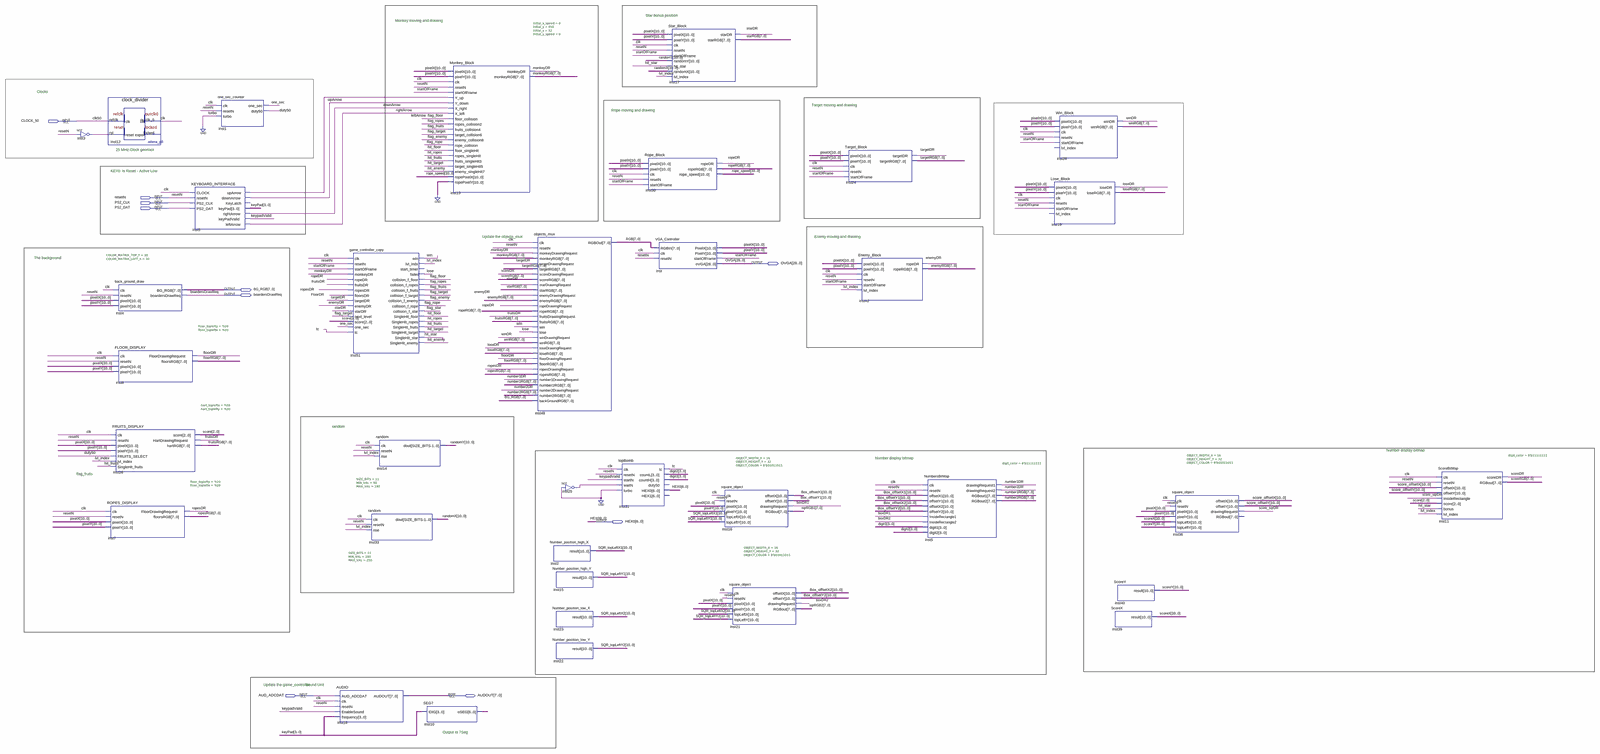
[diagram p0: schematic sheet, whole]
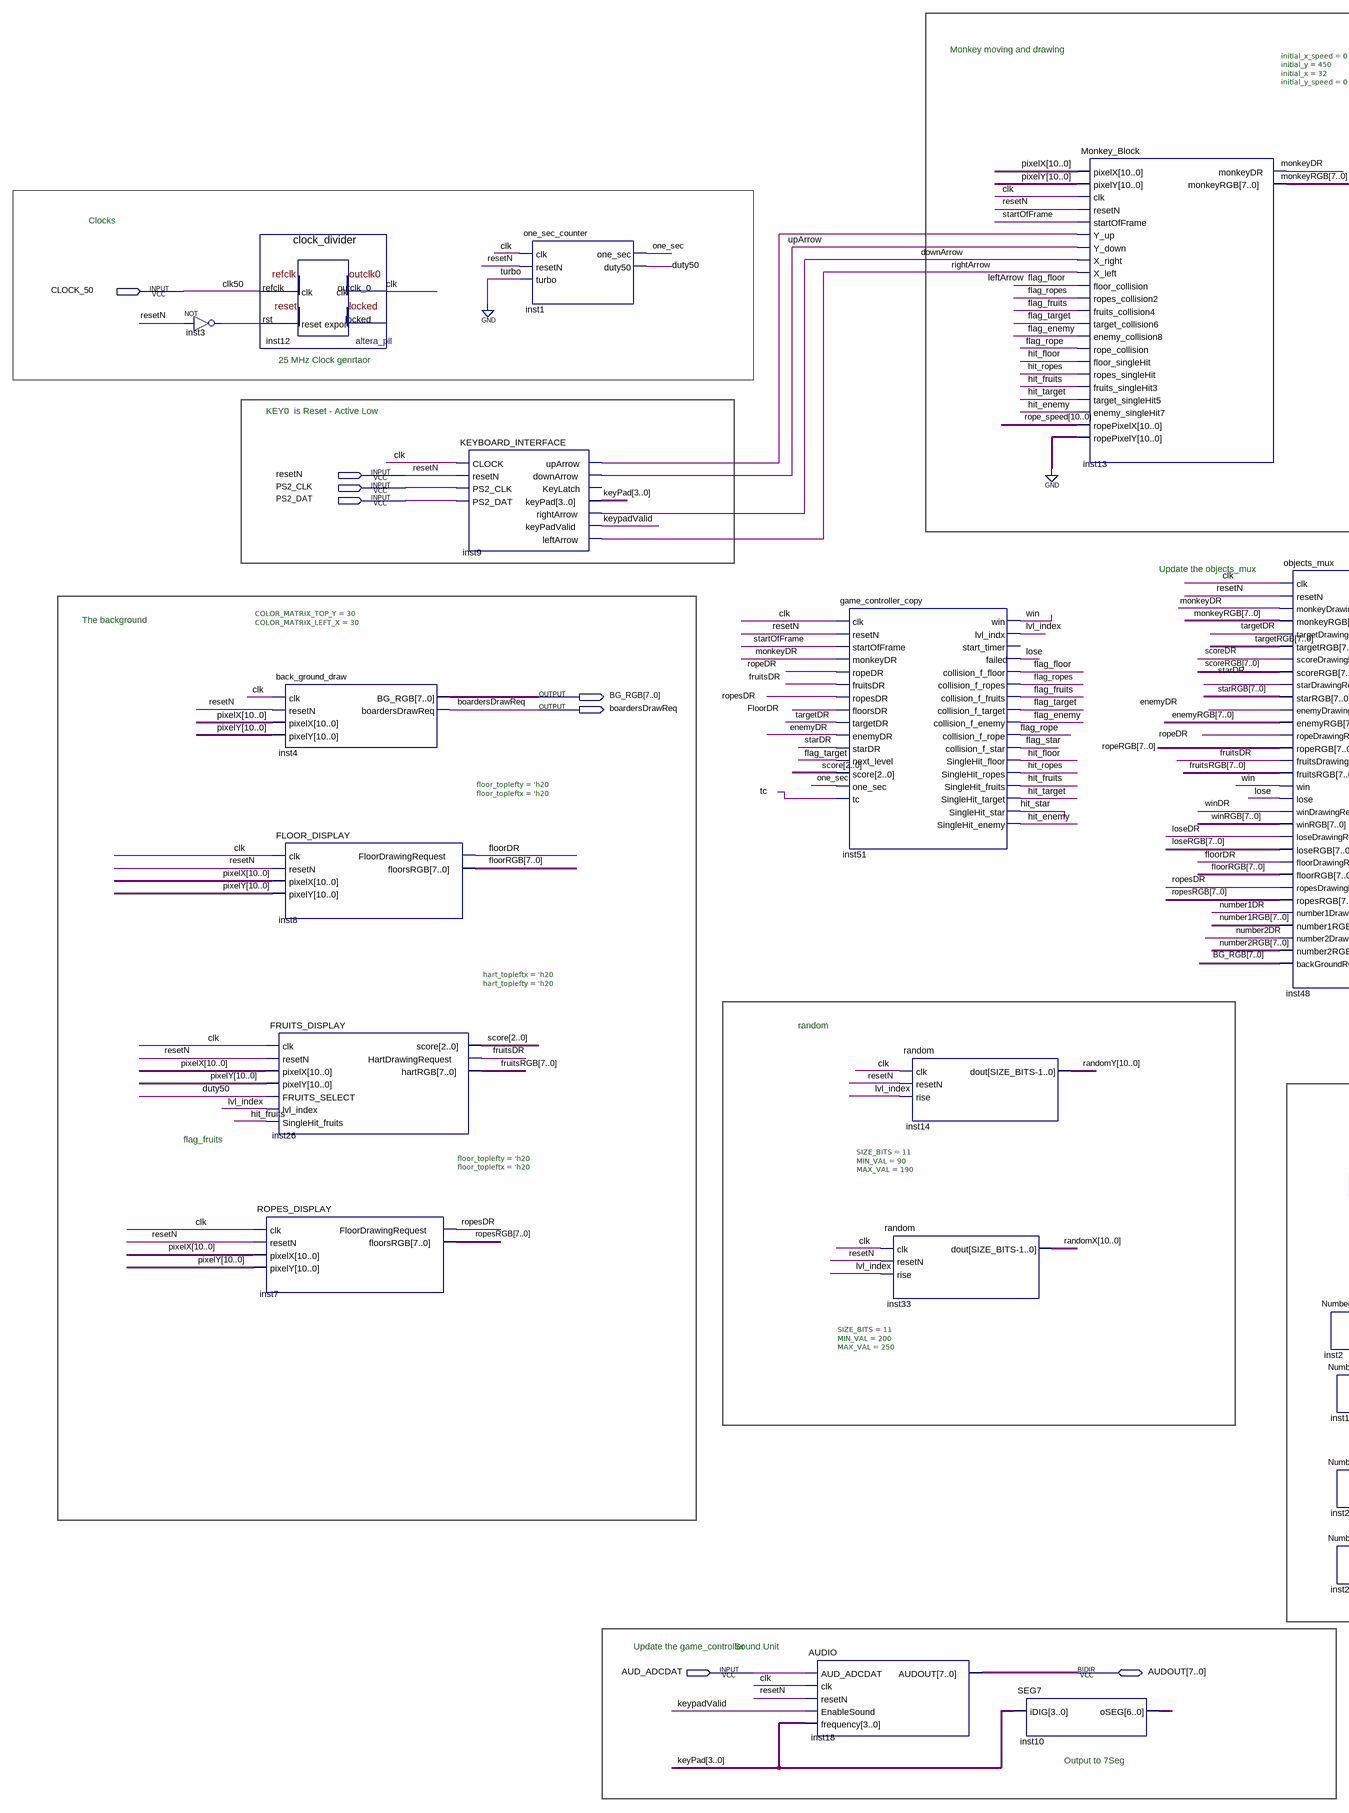
[diagram p1: schematic sheet, left part]
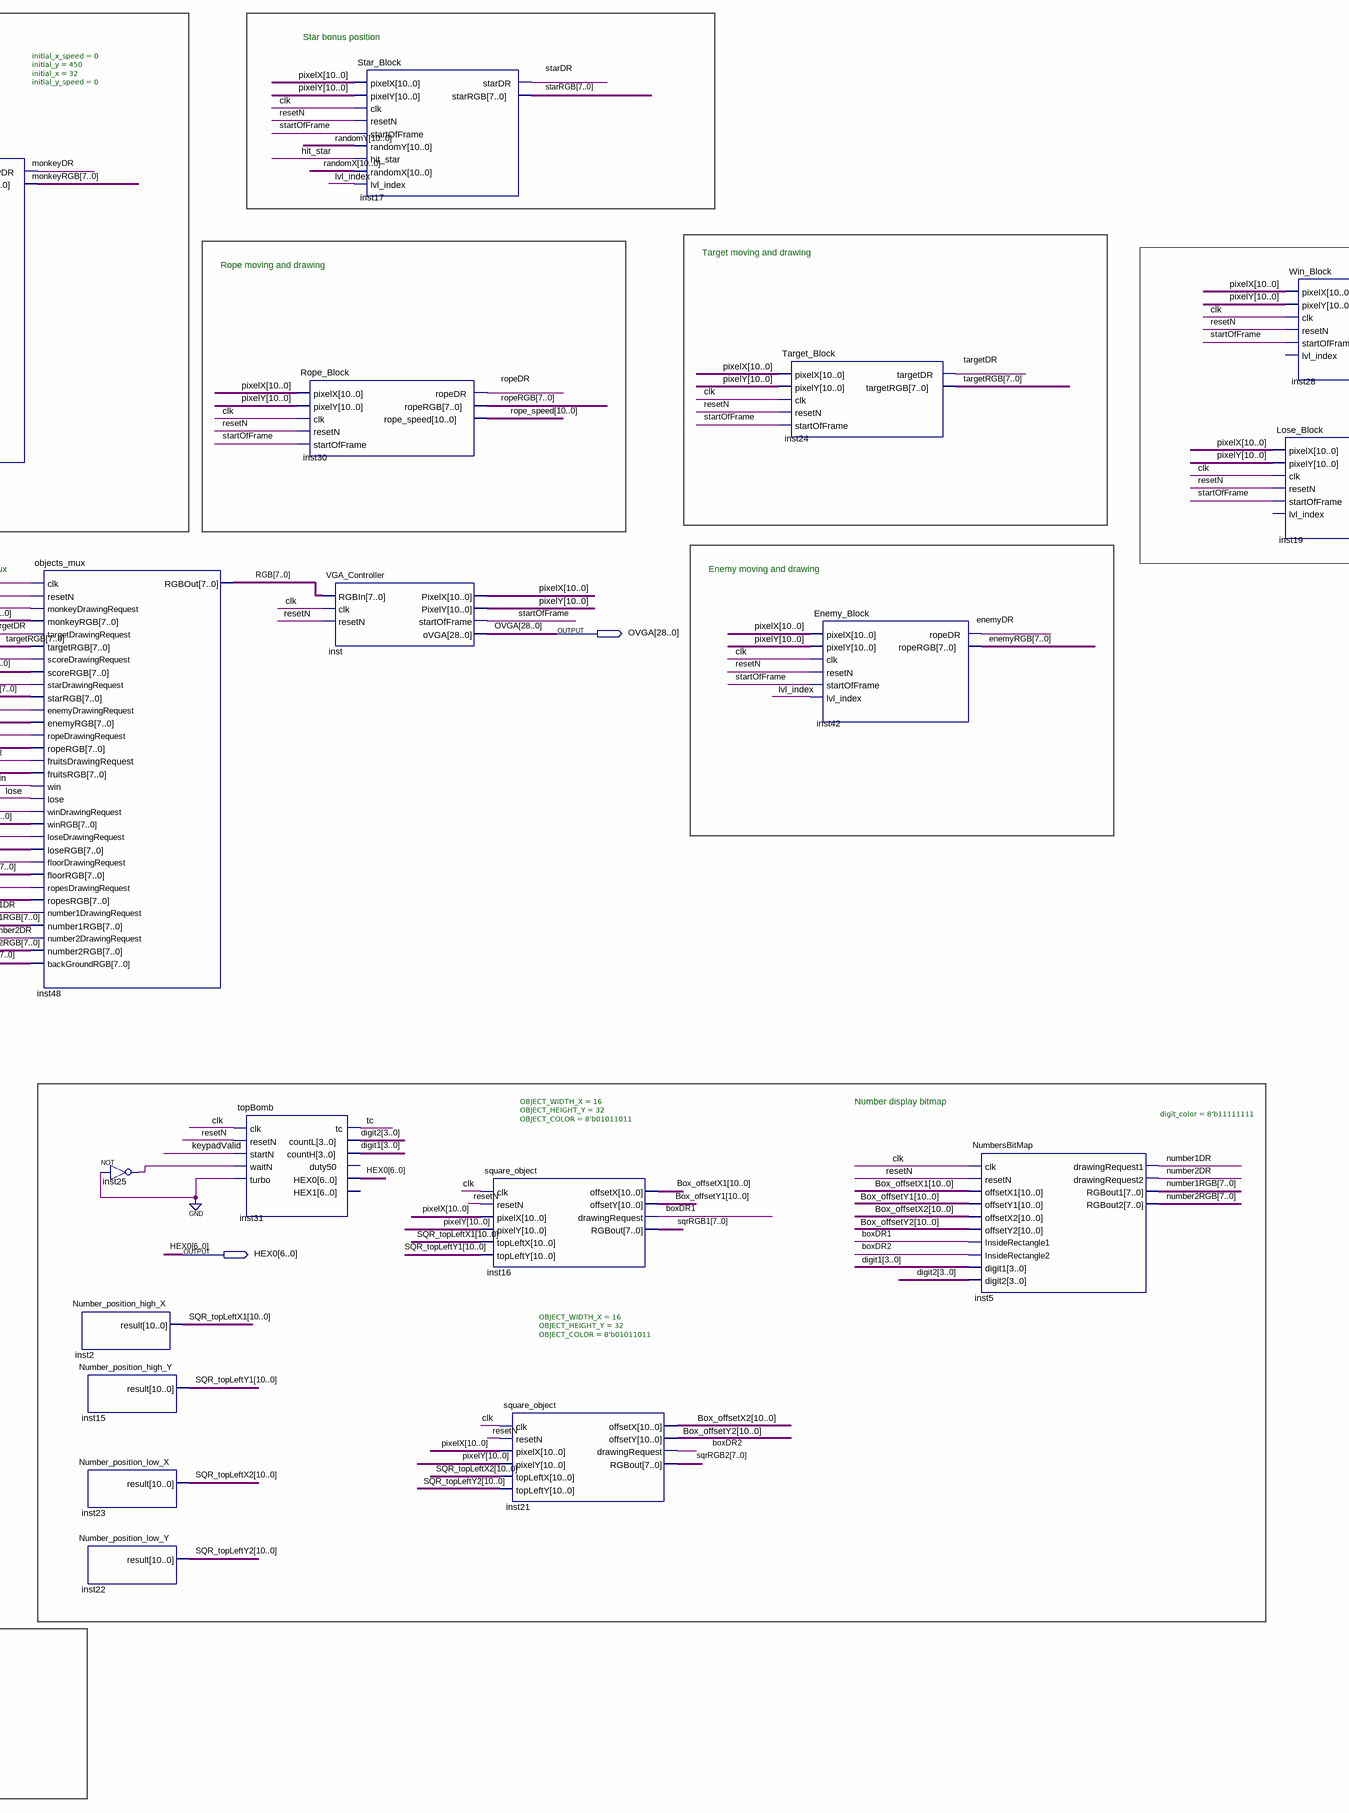
[diagram p2: schematic sheet, centre part]
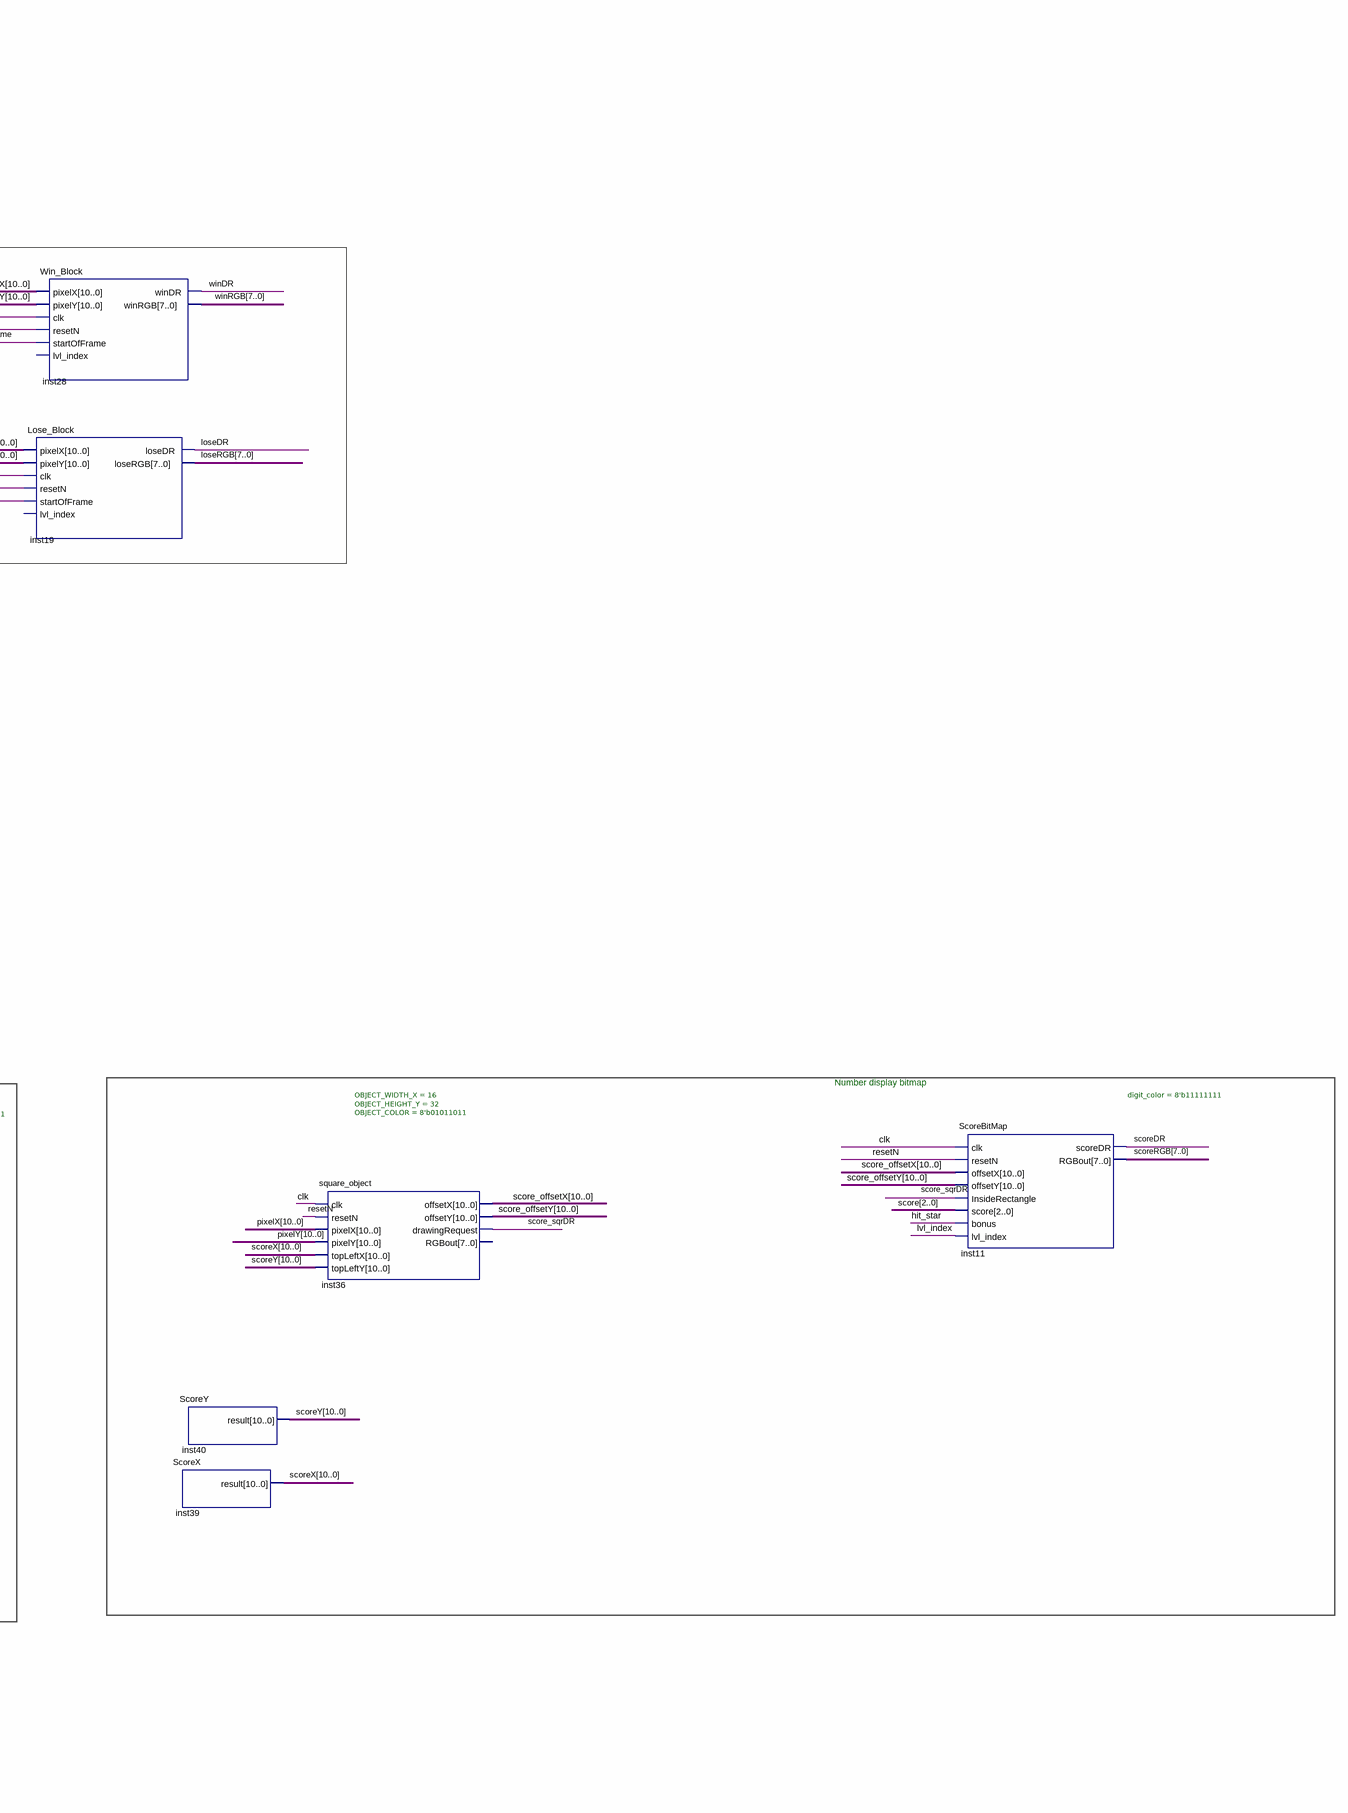
[diagram p3: schematic sheet, right part]
// Quartus schematic TOP_VGA_DEMO_KBD.bdf as structural Verilog: 35 symbols, 10 pins
module TOP_VGA_DEMO_KBD (
  input  CLOCK_50,
  input  resetN,
  input  PS2_CLK,
  input  PS2_DAT,
  input  AUD_ADCDAT,
  inout  [7:0] AUDOUT,
  output [28:0] OVGA,
  output [7:0] BG_RGB,
  output boardersDrawReq,
  output [6:0] HEX0
);

  wire boxDR1, boxDR2, clk, downArrow, duty50, enemyDR, flag_enemy, flag_floor, flag_fruits, flag_rope,
       flag_ropes, flag_star, flag_target, FloorDR, fruitsDR, hit_enemy, hit_floor, hit_fruits, hit_ropes,
       hit_star, hit_target, inst3_out, inst25_out, keypadValid, leftArrow, lose, loseDR, lvl_index,
       monkeyDR, number1DR, number2DR, one_sec, rightArrow, ropeDR, ropesDR, score_sqrDR, scoreDR, starDR,
       startOfFrame, targetDR, tc, upArrow, win, winDR;
  wire [2:0] score;
  wire [3:0] digit1, digit2, keyPad;
  wire [6:0] inst10_oseg;
  wire [7:0] enemyRGB, floorRGB, fruitsRGB, loseRGB, monkeyRGB, number1RGB, number2RGB, RGB, ropeRGB,
       ropesRGB, scoreRGB, sqrRGB1, sqrRGB2, starRGB, targetRGB, winRGB;
  wire [10:0] Box_offsetX1, Box_offsetX2, Box_offsetY1, Box_offsetY2, pixelX, pixelY, randomX, randomY,
       rope_speed, score_offsetX, score_offsetY, scoreX, scoreY, SQR_topLeftX1, SQR_topLeftX2, SQR_topLeftY1,
       SQR_topLeftY2;

  not inst3 (inst3_out, resetN);
  clock_divider inst12 (.refclk(CLOCK_50), .rst(inst3_out), .outclk_0(clk));  // open: locked
  FRUITS_DISPLAY #(.hart_topleftx('h20), .hart_toplefty('h20)) inst26 (
    .clk(clk), .resetN(resetN), .pixelX(pixelX), .pixelY(pixelY), .FRUITS_SELECT(duty50),
    .lvl_index(lvl_index), .SingleHit_fruits(hit_fruits), .score(score), .HartDrawingRequest(fruitsDR),
    .hartRGB(fruitsRGB));
  ROPES_DISPLAY #(.floor_toplefty('h20), .floor_topleftx('h20)) inst7 (
    .clk(clk), .resetN(resetN), .pixelX(pixelX), .pixelY(pixelY), .FloorDrawingRequest(ropesDR),
    .floorsRGB(ropesRGB));
  back_ground_draw #(.COLOR_MATRIX_TOP_Y(30), .COLOR_MATRIX_LEFT_X(30)) inst4 (
    .clk(clk), .resetN(resetN), .pixelX(pixelX), .pixelY(pixelY), .BG_RGB(BG_RGB),
    .boardersDrawReq(boardersDrawReq));
  FLOOR_DISPLAY #(.floor_toplefty('h20), .floor_topleftx('h20)) inst8 (
    .clk(clk), .resetN(resetN), .pixelX(pixelX), .pixelY(pixelY), .FloorDrawingRequest(FloorDR),
    .floorsRGB(floorRGB));
  KEYBOARD_INTERFACE inst9 (
    .CLOCK(clk), .resetN(resetN), .PS2_CLK(PS2_CLK), .PS2_DAT(PS2_DAT), .upArrow(upArrow),
    .downArrow(downArrow), .keyPad(keyPad), .rightArrow(rightArrow), .keyPadValid(keypadValid),
    .leftArrow(leftArrow));  // open: KeyLatch
  one_sec_counter inst1 (.clk(clk), .resetN(resetN), .turbo(1'b0), .one_sec(one_sec), .duty50(duty50));
  AUDIO inst18 (
    .AUD_ADCDAT(AUD_ADCDAT), .clk(clk), .resetN(resetN), .EnableSound(keypadValid), .frequency(keyPad),
    .AUDOUT(AUDOUT));
  game_controller_copy inst51 (
    .clk(clk), .resetN(resetN), .startOfFrame(startOfFrame), .monkeyDR(monkeyDR), .ropeDR(ropeDR),
    .fruitsDR(fruitsDR), .ropesDR(ropesDR), .floorsDR(FloorDR), .targetDR(targetDR), .enemyDR(enemyDR),
    .starDR(starDR), .next_level(flag_target), .score(score), .one_sec(one_sec), .tc(tc), .win(win),
    .lvl_indx(lvl_index), .failed(lose), .collision_f_floor(flag_floor), .collision_f_ropes(flag_ropes),
    .collision_f_fruits(flag_fruits), .collision_f_target(flag_target), .collision_f_enemy(flag_enemy),
    .collision_f_rope(flag_rope), .collision_f_star(flag_star), .SingleHit_floor(hit_floor),
    .SingleHit_ropes(hit_ropes), .SingleHit_fruits(hit_fruits), .SingleHit_target(hit_target),
    .SingleHit_star(hit_star), .SingleHit_enemy(hit_enemy));  // open: start_timer
  random #(.SIZE_BITS(11), .MIN_VAL(90), .MAX_VAL(190)) inst14 (
    .clk(clk), .resetN(resetN), .rise(lvl_index), .dout(randomY));
  random #(.SIZE_BITS(11), .MIN_VAL(200), .MAX_VAL(250)) inst33 (
    .clk(clk), .resetN(resetN), .rise(lvl_index), .dout(randomX));
  SEG7 inst10 (.iDIG(keyPad), .oSEG(inst10_oseg));
  Monkey_Block #(.initial_x_speed(0), .initial_y(450), .initial_x(32), .initial_y_speed(0)) inst13 (
    .pixelX(pixelX), .pixelY(pixelY), .clk(clk), .resetN(resetN), .startOfFrame(startOfFrame),
    .Y_up(upArrow), .Y_down(downArrow), .X_right(rightArrow), .X_left(leftArrow),
    .floor_collision(flag_floor), .ropes_collision2(flag_ropes), .fruits_collision4(flag_fruits),
    .target_collision6(flag_target), .enemy_collision8(flag_enemy), .rope_collision(flag_rope),
    .floor_singleHit(hit_floor), .ropes_singleHit(hit_ropes), .fruits_singleHit3(hit_fruits),
    .target_singleHit5(hit_target), .enemy_singleHit7(hit_enemy), .ropePixelX(rope_speed),
    .ropePixelY({11{1'b0}}), .monkeyDR(monkeyDR), .monkeyRGB(monkeyRGB));
  objects_mux inst48 (
    .clk(clk), .resetN(resetN), .monkeyDrawingRequest(monkeyDR), .monkeyRGB(monkeyRGB),
    .targetDrawingRequest(targetDR), .targetRGB(targetRGB), .scoreDrawingRequest(scoreDR),
    .scoreRGB(scoreRGB), .starDrawingRequest(starDR), .starRGB(starRGB), .enemyDrawingRequest(enemyDR),
    .enemyRGB(enemyRGB), .ropeDrawingRequest(ropeDR), .ropeRGB(ropeRGB), .fruitsDrawingRequest(fruitsDR),
    .fruitsRGB(fruitsRGB), .win(win), .lose(lose), .winDrawingRequest(winDR), .winRGB(winRGB),
    .loseDrawingRequest(loseDR), .loseRGB(loseRGB), .floorDrawingRequest(FloorDR), .floorRGB(floorRGB),
    .ropesDrawingRequest(ropesDR), .ropesRGB(ropesRGB), .number1DrawingRequest(number1DR),
    .number1RGB(number1RGB), .number2DrawingRequest(number2DR), .number2RGB(number2RGB),
    .backGroundRGB(BG_RGB), .RGBOut(RGB));
  Number_position_high_X inst2 (.result(SQR_topLeftX1));
  Number_position_high_Y inst15 (.result(SQR_topLeftY1));
  Number_position_low_X inst23 (.result(SQR_topLeftX2));
  Number_position_low_Y inst22 (.result(SQR_topLeftY2));
  not inst25 (inst25_out, 1'b0);
  topBomb inst31 (
    .clk(clk), .resetN(resetN), .startN(keypadValid), .waitN(inst25_out), .turbo(1'b0), .tc(tc),
    .countL(digit2), .countH(digit1), .HEX0(HEX0));  // open: duty50, HEX1
  Rope_Block inst30 (
    .pixelX(pixelX), .pixelY(pixelY), .clk(clk), .resetN(resetN), .startOfFrame(startOfFrame),
    .ropeDR(ropeDR), .ropeRGB(ropeRGB), .rope_speed(rope_speed));
  VGA_Controller inst (
    .RGBIn(RGB), .clk(clk), .resetN(resetN), .PixelX(pixelX), .PixelY(pixelY), .startOfFrame(startOfFrame),
    .oVGA(OVGA));
  Star_Block inst17 (
    .pixelX(pixelX), .pixelY(pixelY), .clk(clk), .resetN(resetN), .startOfFrame(startOfFrame),
    .randomY(randomY), .hit_star(hit_star), .randomX(randomX), .lvl_index(lvl_index), .starDR(starDR),
    .starRGB(starRGB));
  square_object #(.OBJECT_WIDTH_X(16), .OBJECT_HEIGHT_Y(32), .OBJECT_COLOR(8'b01011011)) inst16 (
    .clk(clk), .resetN(resetN), .pixelX(pixelX), .pixelY(pixelY), .topLeftX(SQR_topLeftX1),
    .topLeftY(SQR_topLeftY1), .offsetX(Box_offsetX1), .offsetY(Box_offsetY1), .drawingRequest(boxDR1),
    .RGBout(sqrRGB1));
  square_object #(.OBJECT_WIDTH_X(16), .OBJECT_HEIGHT_Y(32), .OBJECT_COLOR(8'b01011011)) inst21 (
    .clk(clk), .resetN(resetN), .pixelX(pixelX), .pixelY(pixelY), .topLeftX(SQR_topLeftX2),
    .topLeftY(SQR_topLeftY2), .offsetX(Box_offsetX2), .offsetY(Box_offsetY2), .drawingRequest(boxDR2),
    .RGBout(sqrRGB2));
  Target_Block inst24 (
    .pixelX(pixelX), .pixelY(pixelY), .clk(clk), .resetN(resetN), .startOfFrame(startOfFrame),
    .targetDR(targetDR), .targetRGB(targetRGB));
  Enemy_Block inst42 (
    .pixelX(pixelX), .pixelY(pixelY), .clk(clk), .resetN(resetN), .startOfFrame(startOfFrame),
    .lvl_index(lvl_index), .ropeDR(enemyDR), .ropeRGB(enemyRGB));
  NumbersBitMap #(.digit_color(8'b11111111)) inst5 (
    .clk(clk), .resetN(resetN), .offsetX1(Box_offsetX1), .offsetY1(Box_offsetY1), .offsetX2(Box_offsetX2),
    .offsetY2(Box_offsetY2), .InsideRectangle1(boxDR1), .InsideRectangle2(boxDR2), .digit1(digit1),
    .digit2(digit2), .drawingRequest1(number1DR), .drawingRequest2(number2DR), .RGBout1(number1RGB),
    .RGBout2(number2RGB));
  Win_Block inst28 (
    .pixelX(pixelX), .pixelY(pixelY), .clk(clk), .resetN(resetN), .startOfFrame(startOfFrame), .winDR(winDR),
    .winRGB(winRGB));  // open: lvl_index
  Lose_Block inst19 (
    .pixelX(pixelX), .pixelY(pixelY), .clk(clk), .resetN(resetN), .startOfFrame(startOfFrame),
    .loseDR(loseDR), .loseRGB(loseRGB));  // open: lvl_index
  ScoreY inst40 (.result(scoreY));
  ScoreX inst39 (.result(scoreX));
  square_object #(.OBJECT_WIDTH_X(16), .OBJECT_HEIGHT_Y(32), .OBJECT_COLOR(8'b01011011)) inst36 (
    .clk(clk), .resetN(resetN), .pixelX(pixelX), .pixelY(pixelY), .topLeftX(scoreX), .topLeftY(scoreY),
    .offsetX(score_offsetX), .offsetY(score_offsetY), .drawingRequest(score_sqrDR));  // open: RGBout
  ScoreBitMap #(.digit_color(8'b11111111)) inst11 (
    .clk(clk), .resetN(resetN), .offsetX(score_offsetX), .offsetY(score_offsetY),
    .InsideRectangle(score_sqrDR), .score(score), .bonus(hit_star), .lvl_index(lvl_index), .scoreDR(scoreDR),
    .RGBout(scoreRGB));

  // Other names for the same wires on the sheet: clk50 = CLOCK_50

  // Notes on the sheet:
  //   Star bonus position
  //   Monkey moving and drawing
  //   Clocks
  //   Target moving and drawing
  //   Rope moving and drawing
  //   25 MHz Clock genrtaor
  //   KEY0  is Reset - Active Low
  //   Update the objects_mux
  //   Enemy moving and drawing
  //   The background
  //   random
  //   Number display bitmap
  //   Number display bitmap
  //   flag_fruits
  //   Update the game_controller
  //   Sound Unit
  //   Output to 7Seg
endmodule
